# EAGLE schematic PCIE_dual_breakout_2L_v0.2 (EAGLE 7.7.0)
Assembly variants: Beta
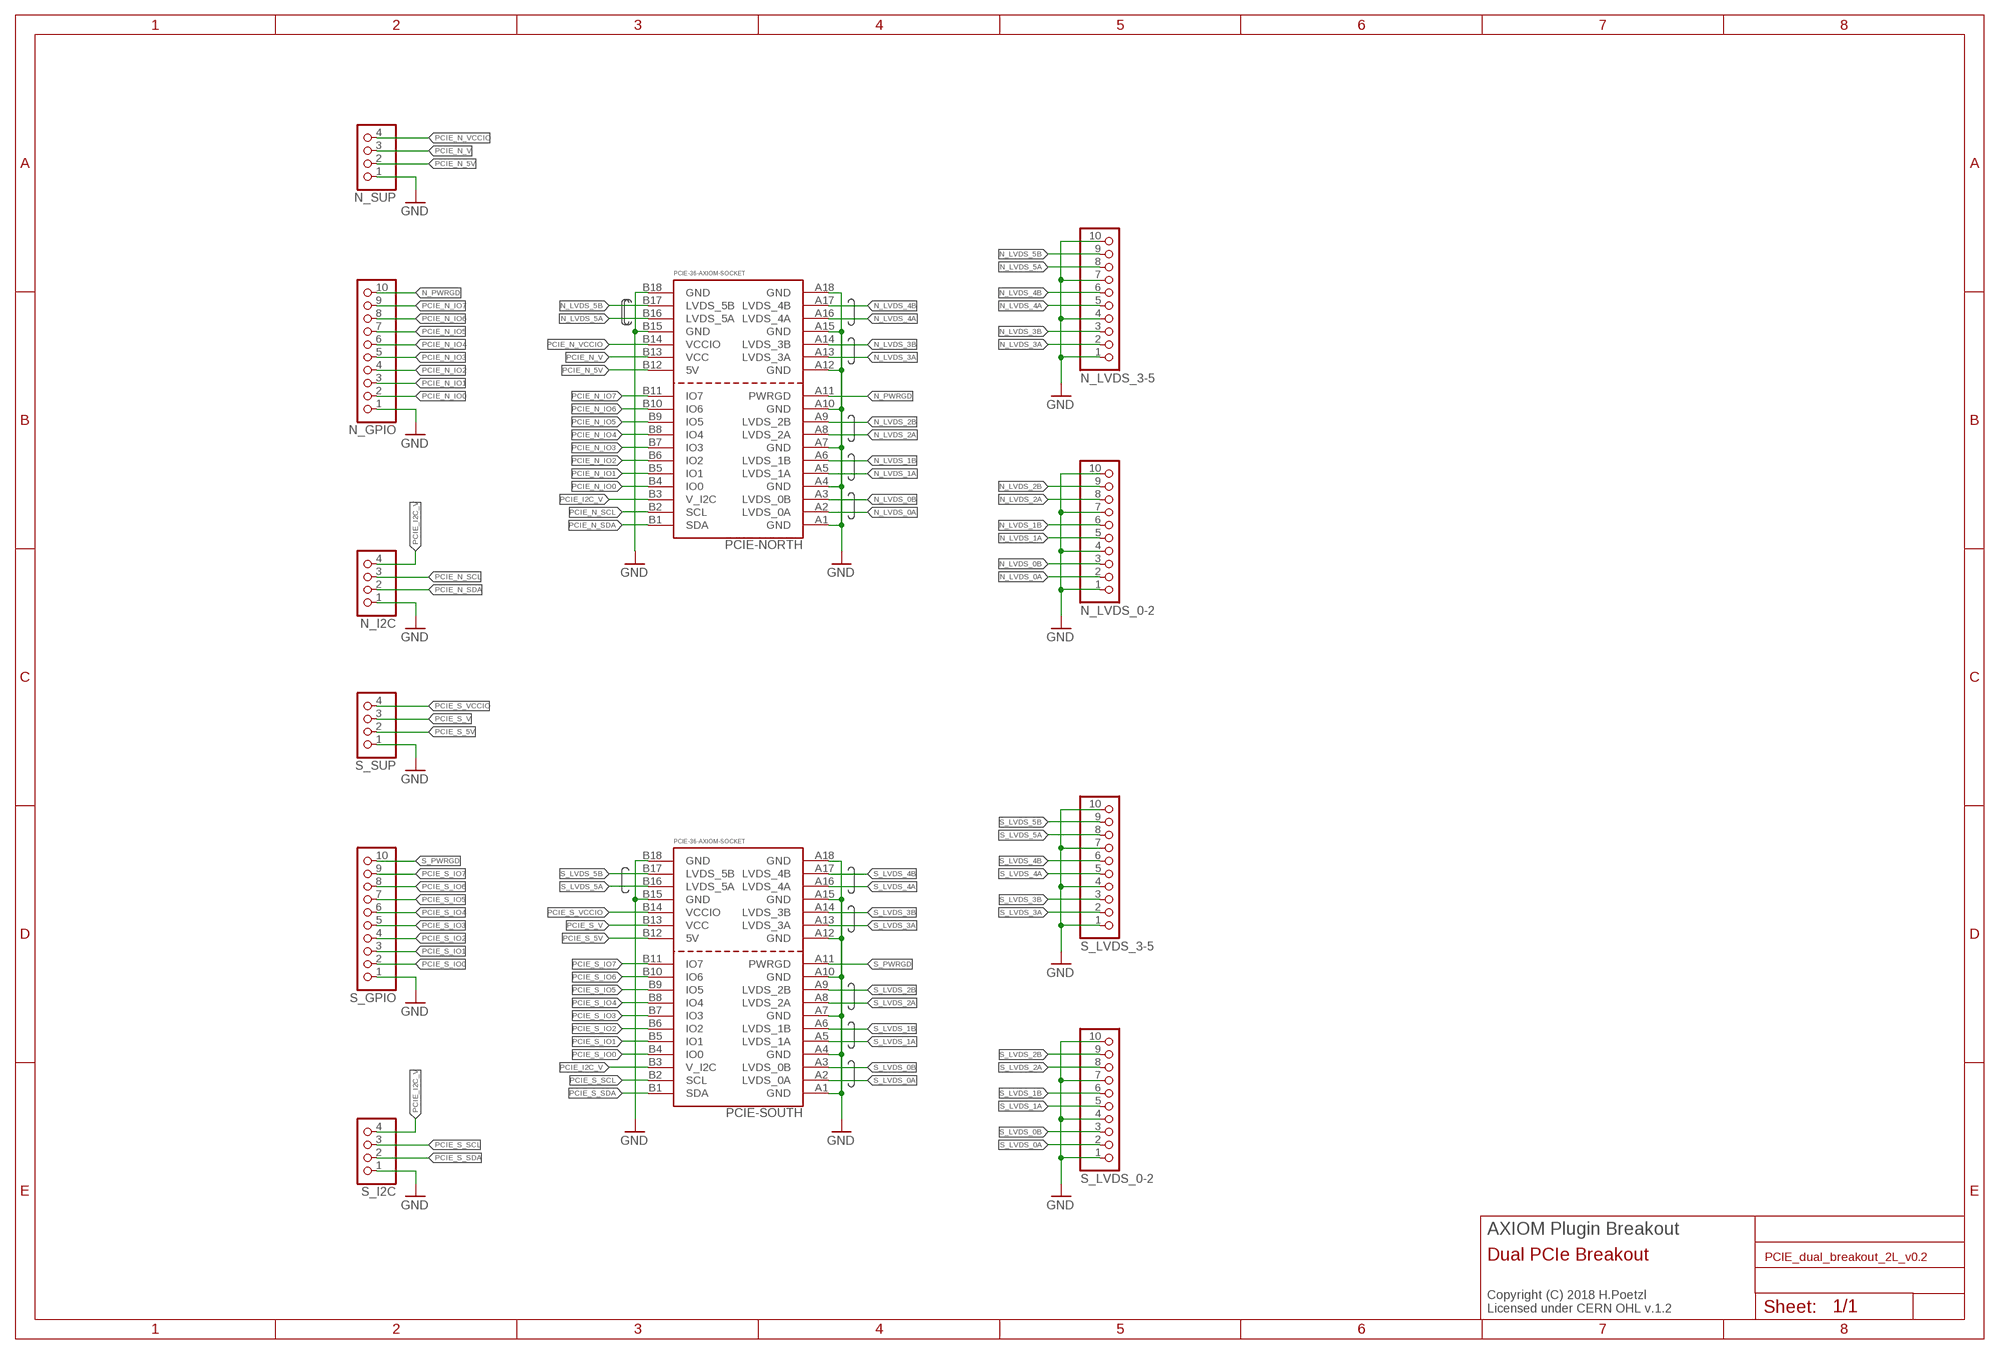
[diagram p0: schematic, sheet 1]

## Parts
N_GPIO  PINHD-1X10_2.54-S  [1X10-S]
N_I2C  PINHD-1X04_2.54-S  [1X04-S]
N_LVDS_0-2  PINHD-1X10_2.54-S  [1X10-S]
N_LVDS_3-5  PINHD-1X10_2.54-S  [1X10-S]
N_SUP  PINHD-1X04_2.54-S  [1X04-S]
PCIE-NORTH  PCIE-36-AXIOM-SOCKET  [PCIE-36]
PCIE-SOUTH  PCIE-36-AXIOM-SOCKET  [PCIE-36]
S_GPIO  PINHD-1X10_2.54-S  [1X10-S]
S_I2C  PINHD-1X04_2.54-S  [1X04-S]
S_LVDS_0-2  PINHD-1X10_2.54-S  [1X10-S]
S_LVDS_3-5  PINHD-1X10_2.54-S  [1X10-S]
S_SUP  PINHD-1X04_2.54-S  [1X04-S]

## Nets
GND: N_GPIO.1 N_I2C.1 N_LVDS_0-2.1 N_LVDS_0-2.4 N_LVDS_0-2.7 N_LVDS_0-2.10 N_LVDS_3-5.1 N_LVDS_3-5.4 N_LVDS_3-5.7 N_LVDS_3-5.10 N_SUP.1 PCIE-NORTH.A1(GND) PCIE-NORTH.A4(GND) PCIE-NORTH.A7(GND) PCIE-NORTH.A10(GND) PCIE-NORTH.A12(GND) PCIE-NORTH.A15(GND) PCIE-NORTH.A18(GND) PCIE-NORTH.B15(GND) PCIE-NORTH.B18(GND) PCIE-SOUTH.A1(GND) PCIE-SOUTH.A4(GND) PCIE-SOUTH.A7(GND) PCIE-SOUTH.A10(GND) PCIE-SOUTH.A12(GND) PCIE-SOUTH.A15(GND) PCIE-SOUTH.A18(GND) PCIE-SOUTH.B15(GND) PCIE-SOUTH.B18(GND) S_GPIO.1 S_I2C.1 S_LVDS_0-2.1 S_LVDS_0-2.4 S_LVDS_0-2.7 S_LVDS_0-2.10 S_LVDS_3-5.1 S_LVDS_3-5.4 S_LVDS_3-5.7 S_LVDS_3-5.10 S_SUP.1
N_LVDS_0A [power]: N_LVDS_0-2.2 PCIE-NORTH.A2(LVDS_0A)
N_LVDS_0B [power]: N_LVDS_0-2.3 PCIE-NORTH.A3(LVDS_0B)
N_LVDS_1A: N_LVDS_0-2.5 PCIE-NORTH.A5(LVDS_1A)
N_LVDS_1B: N_LVDS_0-2.6 PCIE-NORTH.A6(LVDS_1B)
N_LVDS_2A [power]: N_LVDS_0-2.8 PCIE-NORTH.A8(LVDS_2A)
N_LVDS_2B [power]: N_LVDS_0-2.9 PCIE-NORTH.A9(LVDS_2B)
N_LVDS_3A [power]: N_LVDS_3-5.2 PCIE-NORTH.A13(LVDS_3A)
N_LVDS_3B [power]: N_LVDS_3-5.3 PCIE-NORTH.A14(LVDS_3B)
N_LVDS_4A [power]: N_LVDS_3-5.5 PCIE-NORTH.A16(LVDS_4A)
N_LVDS_4B [power]: N_LVDS_3-5.6 PCIE-NORTH.A17(LVDS_4B)
N_LVDS_5A [power]: N_LVDS_3-5.8 PCIE-NORTH.B16(LVDS_5A)
N_LVDS_5B [power]: N_LVDS_3-5.9 PCIE-NORTH.B17(LVDS_5B)
N_PWRGD: N_GPIO.10 PCIE-NORTH.A11(PWRGD)
PCIE_I2C_V [power]: N_I2C.4 PCIE-NORTH.B3(V_I2C) PCIE-SOUTH.B3(V_I2C) S_I2C.4
PCIE_N_5V: N_SUP.2 PCIE-NORTH.B12(5V)
PCIE_N_IO0: N_GPIO.2 PCIE-NORTH.B4(IO0)
PCIE_N_IO1: N_GPIO.3 PCIE-NORTH.B5(IO1)
PCIE_N_IO2: N_GPIO.4 PCIE-NORTH.B6(IO2)
PCIE_N_IO3: N_GPIO.5 PCIE-NORTH.B7(IO3)
PCIE_N_IO4: N_GPIO.6 PCIE-NORTH.B8(IO4)
PCIE_N_IO5: N_GPIO.7 PCIE-NORTH.B9(IO5)
PCIE_N_IO6: N_GPIO.8 PCIE-NORTH.B10(IO6)
PCIE_N_IO7: N_GPIO.9 PCIE-NORTH.B11(IO7)
PCIE_N_SCL: N_I2C.3 PCIE-NORTH.B2(SCL)
PCIE_N_SDA: N_I2C.2 PCIE-NORTH.B1(SDA)
PCIE_N_V: N_SUP.3 PCIE-NORTH.B13(VCC)
PCIE_N_VCCIO: N_SUP.4 PCIE-NORTH.B14(VCCIO)
PCIE_S_5V: PCIE-SOUTH.B12(5V) S_SUP.2
PCIE_S_IO0: PCIE-SOUTH.B4(IO0) S_GPIO.2
PCIE_S_IO1: PCIE-SOUTH.B5(IO1) S_GPIO.3
PCIE_S_IO2: PCIE-SOUTH.B6(IO2) S_GPIO.4
PCIE_S_IO3: PCIE-SOUTH.B7(IO3) S_GPIO.5
PCIE_S_IO4: PCIE-SOUTH.B8(IO4) S_GPIO.6
PCIE_S_IO5: PCIE-SOUTH.B9(IO5) S_GPIO.7
PCIE_S_IO6: PCIE-SOUTH.B10(IO6) S_GPIO.8
PCIE_S_IO7: PCIE-SOUTH.B11(IO7) S_GPIO.9
PCIE_S_SCL: PCIE-SOUTH.B2(SCL) S_I2C.3
PCIE_S_SDA: PCIE-SOUTH.B1(SDA) S_I2C.2
PCIE_S_V: PCIE-SOUTH.B13(VCC) S_SUP.3
PCIE_S_VCCIO: PCIE-SOUTH.B14(VCCIO) S_SUP.4
S_LVDS_0A: PCIE-SOUTH.A2(LVDS_0A) S_LVDS_0-2.2
S_LVDS_0B: PCIE-SOUTH.A3(LVDS_0B) S_LVDS_0-2.3
S_LVDS_1A [power]: PCIE-SOUTH.A5(LVDS_1A) S_LVDS_0-2.5
S_LVDS_1B [power]: PCIE-SOUTH.A6(LVDS_1B) S_LVDS_0-2.6
S_LVDS_2A [power]: PCIE-SOUTH.A8(LVDS_2A) S_LVDS_0-2.8
S_LVDS_2B [power]: PCIE-SOUTH.A9(LVDS_2B) S_LVDS_0-2.9
S_LVDS_3A: PCIE-SOUTH.A13(LVDS_3A) S_LVDS_3-5.2
S_LVDS_3B: PCIE-SOUTH.A14(LVDS_3B) S_LVDS_3-5.3
S_LVDS_4A [power]: PCIE-SOUTH.A16(LVDS_4A) S_LVDS_3-5.5
S_LVDS_4B [power]: PCIE-SOUTH.A17(LVDS_4B) S_LVDS_3-5.6
S_LVDS_5A [power]: PCIE-SOUTH.B16(LVDS_5A) S_LVDS_3-5.8
S_LVDS_5B [power]: PCIE-SOUTH.B17(LVDS_5B) S_LVDS_3-5.9
S_PWRGD: PCIE-SOUTH.A11(PWRGD) S_GPIO.10

## Notes on the sheet
- AXIOM Plugin Breakout
- Dual PCIe Breakout
- Copyright (C) 2018 H.Poetzl
  Licensed under CERN OHL v.1.2

## Library data of the parts
N_GPIO N_LVDS_0-2 N_LVDS_3-5 S_GPIO S_LVDS_0-2 S_LVDS_3-5 = pinhead-2:PINHD-1X10: PIN HEADER
N_I2C N_SUP S_I2C S_SUP = pinhead-2:PINHD-1X04: PIN HEADER
PCIE-NORTH PCIE-SOUTH = PCIe:PCIE-36-AXIOM

## Net classes
0 default: width 0.152 mm, drill 0.203 mm
1 power: width 0.152 mm, drill 0.203 mm